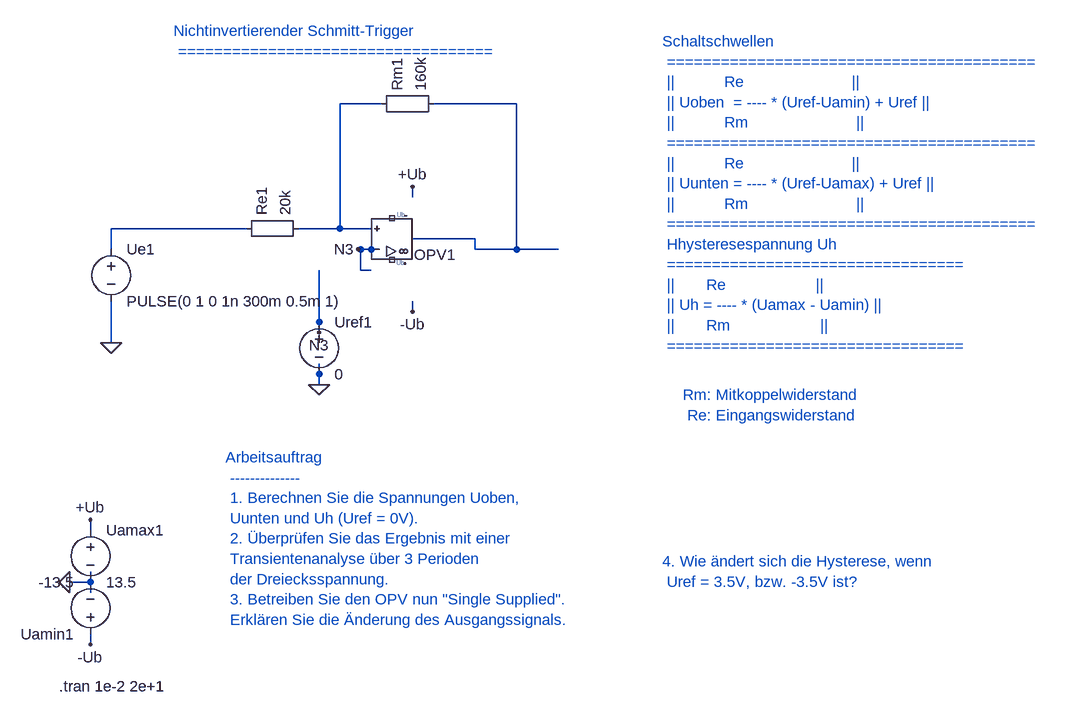
[diagram p0: schematic 2_2_3_nichtinvertierender_Schmitt-Trigger.asc]
2_2_3_nichtinvertierender_Schmitt-Trigger.asc, the LTspice schematic file:
Version 4
SHEET 1 880 680
WIRE 544 384 528 384
WIRE 528 384 528 416
WIRE 528 416 544 416
WIRE 608 368 704 368
WIRE 704 368 704 384
WIRE 112 896 112 880
WIRE 464 576 464 560
WIRE 144 464 144 480
WIRE 112 896 112 912
WIRE 112 816 112 800
WIRE 608 304 608 288
WIRE 640 160 768 160
WIRE 768 160 768 384
WIRE 432 352 496 352
WIRE 496 352 544 352
WIRE 560 160 496 160
WIRE 496 160 496 352
WIRE 464 416 464 496
WIRE 464 592 464 560
WIRE 144 528 144 480
WIRE 144 384 144 352
WIRE 144 352 352 352
WIRE 80 896 112 896
WIRE 608 464 608 480
WIRE 768 384 704 384
WIRE 832 384 768 384
WIRE 112 976 112 992
WIRE 544 384 524 384
WIRE 464 496 464 512
FLAG 80 896 0
FLAG 464 592 0
FLAG 144 528 0
FLAG 80 896 0
FLAG 464 592 0
FLAG 144 528 0
FLAG 524 384 N3
FLAG 464 512 N3
FLAG 112 800 +Ub
FLAG 608 288 +Ub
FLAG 112 992 -Ub
FLAG 608 480 -Ub
SYMBOL UniversalOpAmp2 576 368 M180
SYMATTR InstName OPV1
SYMATTR Value UniversalOpAmp2
SYMBOL voltage 112 800 R0
SYMATTR InstName Uamax1
SYMATTR Value 13.5
SYMBOL Misc\EuropeanResistor 544 176 R270
SYMATTR InstName Rm1
SYMATTR Value 160k
SYMBOL Misc\EuropeanResistor 336 368 R270
SYMATTR InstName Re1
SYMATTR Value 20k
SYMBOL voltage 464 480 R0
SYMATTR InstName Uref1
SYMATTR Value 0
SYMBOL voltage 144 368 R0
SYMATTR InstName Ue1
SYMATTR Value PULSE(0 1 0 1n 300m 0.5m 1)
SYMBOL voltage 112 992 R180
SYMATTR InstName Uamin1
SYMATTR Value -13.5
TEXT 64 1056 Left 2 !.tran 1e-2 2e+1
TEXT 240 48 Left 2 ;Nichtinvertierender Schmitt-Trigger \n ===================================
TEXT 992 64 Left 2 ;Schaltschwellen \n ========================================= \n ||           Re                        || \n || Uoben  = ---- * (Uref-Uamin) + Uref || \n ||           Rm                        || \n ========================================= \n ||           Re                        || \n || Uunten = ---- * (Uref-Uamax) + Uref || \n ||           Rm                        || \n ========================================= \n Hhysteresespannung Uh \n ================================= \n ||       Re                    || \n || Uh = ---- * (Uamax - Uamin) || \n ||       Rm                    || \n =================================
TEXT 320 704 Left 2 ;Arbeitsauftrag \n -------------- \n 1. Berechnen Sie die Spannungen Uoben, \n Uunten und Uh (Uref = 0V). \n 2. Überprüfen Sie das Ergebnis mit einer \n Transientenanalyse über 3 Perioden \n der Dreiecksspannung. \n 3. Betreiben Sie den OPV nun "Single Supplied". \n Erklären Sie die Änderung des Ausgangssignals.
TEXT 992 864 Left 2 ;4. Wie ändert sich die Hysterese, wenn \n Uref = 3.5V, bzw. -3.5V ist?
TEXT 1024 608 Left 2 ;Rm: Mitkoppelwiderstand \n Re: Eingangswiderstand

The netlist it stands for:
* 2_2_3_nichtinvertierender_Schmitt-Trigger.asc
XOPV1 N002 N3 NC_01 NC_02 N001 level2 UniversalOpAmp2 Avol=1Meg GBW=10Meg Slew=10Meg Ilimit=25m Rail=0 Vos=0 En=0 Enk=0 In=0 Ink=0 Rin=500Meg  ; pins In+ In- V+ V- OUT
V§Uamax1 +Ub 0 13.5
Rm1 N002 N001 160k
Re1 N003 N002 20k
V§Uref1 N3 0 0
V§Ue1 N003 0 PULSE(0 1 0 1n 300m 0.5m 1)
V§Uamin1 -Ub 0 -13.5
.tran 1e-2 2e+1
* Nichtinvertierender Schmitt-Trigger
*  ===================================
* Schaltschwellen
*  =========================================
*  ||           Re                        ||
*  || Uoben  = ---- * (Uref-Uamin) + Uref ||
*  ||           Rm                        ||
*  =========================================
*  ||           Re                        ||
*  || Uunten = ---- * (Uref-Uamax) + Uref ||
*  ||           Rm                        ||
*  =========================================
*  Hhysteresespannung Uh
*  =================================
*  ||       Re                    ||
*  || Uh = ---- * (Uamax - Uamin) ||
*  ||       Rm                    ||
*  =================================
* Arbeitsauftrag
*  --------------
*  1. Berechnen Sie die Spannungen Uoben,
*  Uunten und Uh (Uref = 0V).
*  2. Überprüfen Sie das Ergebnis mit einer
*  Transientenanalyse über 3 Perioden
*  der Dreiecksspannung.
*  3. Betreiben Sie den OPV nun "Single Supplied".
*  Erklären Sie die Änderung des Ausgangssignals.
* 4. Wie ändert sich die Hysterese, wenn
*  Uref = 3.5V, bzw. -3.5V ist?
* Rm: Mitkoppelwiderstand
*  Re: Eingangswiderstand
.lib UniversalOpAmp2.lib
.backanno
.end